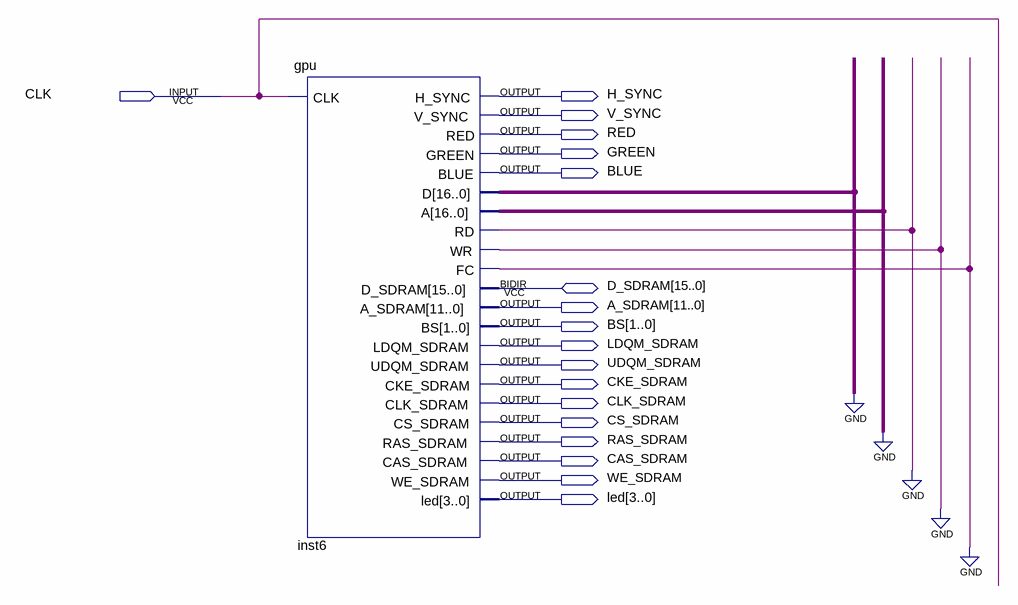
[diagram p0: schematic sheet]
// Quartus schematic main.bdf as structural Verilog: 1 symbols, 18 pins
module main (
  input  CLK,
  inout  [15:0] D_SDRAM,
  output H_SYNC,
  output V_SYNC,
  output RED,
  output GREEN,
  output BLUE,
  output [11:0] A_SDRAM,
  output [1:0] BS,
  output LDQM_SDRAM,
  output UDQM_SDRAM,
  output CKE_SDRAM,
  output CLK_SDRAM,
  output CS_SDRAM,
  output RAS_SDRAM,
  output CAS_SDRAM,
  output WE_SDRAM,
  output [3:0] led
);

  wire inst6_fc, inst6_rd, inst6_wr;
  wire [16:0] inst6_a, inst6_d;

  gpu inst6 (
    .CLK(CLK), .H_SYNC(H_SYNC), .V_SYNC(V_SYNC), .RED(RED), .GREEN(GREEN), .BLUE(BLUE), .A_SDRAM(A_SDRAM),
    .BS(BS), .LDQM_SDRAM(LDQM_SDRAM), .UDQM_SDRAM(UDQM_SDRAM), .CKE_SDRAM(CKE_SDRAM), .CLK_SDRAM(CLK_SDRAM),
    .CS_SDRAM(CS_SDRAM), .RAS_SDRAM(RAS_SDRAM), .CAS_SDRAM(CAS_SDRAM), .WE_SDRAM(WE_SDRAM), .led(led),
    .D(inst6_d), .A(inst6_a), .RD(inst6_rd), .WR(inst6_wr), .FC(inst6_fc), .D_SDRAM(D_SDRAM));
  // also tied to GND on the sheet: {inst6_wr, inst6_fc, inst6_rd, inst6_a[0], inst6_a[1], inst6_a[2], inst6_a[3], inst6_a[4], inst6_a[5], inst6_a[6], inst6_a[7], inst6_a[8], inst6_a[9], inst6_a[10], inst6_a[11], inst6_a[12], inst6_a[13], inst6_a[14], inst6_a[15], inst6_a[16], inst6_d[0], inst6_d[1], inst6_d[2], inst6_d[3], inst6_d[4], inst6_d[5], inst6_d[6], inst6_d[7], inst6_d[8], inst6_d[9], inst6_d[10], inst6_d[11], inst6_d[12], inst6_d[13], inst6_d[14], inst6_d[15], inst6_d[16]}
endmodule
